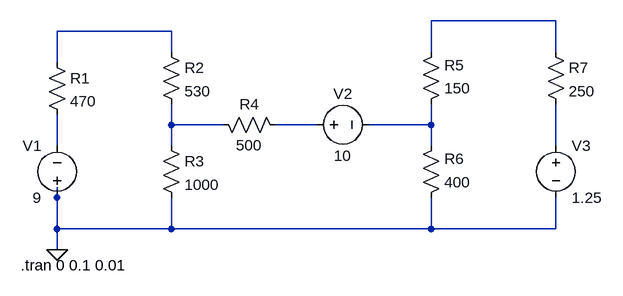
[diagram p0: schematic HUE1.asc]
HUE1.asc, the LTspice schematic file:
Version 4
SHEET 1 912 680
WIRE 720 16 528 16
WIRE 128 32 -48 32
WIRE 128 64 128 32
WIRE 528 64 528 16
WIRE 720 64 720 16
WIRE -48 80 -48 32
WIRE 128 176 128 144
WIRE 208 176 128 176
WIRE 352 176 288 176
WIRE 528 176 528 144
WIRE 528 176 432 176
WIRE -48 208 -48 160
WIRE 128 208 128 176
WIRE 528 208 528 176
WIRE 720 208 720 144
WIRE -48 288 -48 272
WIRE -48 336 -48 288
WIRE 128 336 128 288
WIRE 128 336 -48 336
WIRE 528 336 528 288
WIRE 528 336 128 336
WIRE 720 336 720 288
WIRE 720 336 528 336
WIRE -48 368 -48 336
FLAG -48 368 0
SYMBOL voltage 336 176 M90
WINDOW 0 -32 56 VBottom 2
WINDOW 3 32 56 VTop 2
WINDOW 123 0 0 Left 0
WINDOW 39 0 0 Left 0
SYMATTR InstName V2
SYMATTR Value 10
SYMBOL voltage -48 304 R180
WINDOW 0 24 96 Left 2
WINDOW 3 24 16 Left 2
WINDOW 123 0 0 Left 0
WINDOW 39 0 0 Left 0
SYMATTR InstName V1
SYMATTR Value 9
SYMBOL res -64 64 R0
SYMATTR InstName R1
SYMATTR Value 470
SYMBOL res 112 48 R0
SYMATTR InstName R2
SYMATTR Value 530
SYMBOL res 112 192 R0
SYMATTR InstName R3
SYMATTR Value 1000
SYMBOL res 512 160 M180
WINDOW 0 36 76 Left 2
WINDOW 3 36 40 Left 2
SYMATTR InstName R5
SYMATTR Value 150
SYMBOL res 512 304 M180
WINDOW 0 36 76 Left 2
WINDOW 3 36 40 Left 2
SYMATTR InstName R6
SYMATTR Value 400
SYMBOL res 704 48 R0
SYMATTR InstName R7
SYMATTR Value 250
SYMBOL res 192 160 M90
WINDOW 0 0 56 VBottom 2
WINDOW 3 32 56 VTop 2
SYMATTR InstName R4
SYMATTR Value 500
SYMBOL voltage 720 192 R0
WINDOW 123 0 0 Left 0
WINDOW 39 0 0 Left 0
SYMATTR InstName V3
SYMATTR Value 1.25
TEXT -104 392 Left 2 !.tran 0 0.1 0.01

The netlist it stands for:
* HUE1.asc
V2 N004 N005 10
V1 0 N006 9
R1 N002 N006 470
R2 N002 N003 530
R3 N003 0 1000
R5 N005 N001 150
R6 0 N005 400
R7 N001 N007 250
R4 N003 N004 500
V3 N007 0 1.25
.tran 0 0.1 0.01
.backanno
.end